# Altium schematic sheet PCB_DecoderA.SchDoc
size A4; DocumentNumber: 3; SheetNumber: 3; SheetTotal: 8
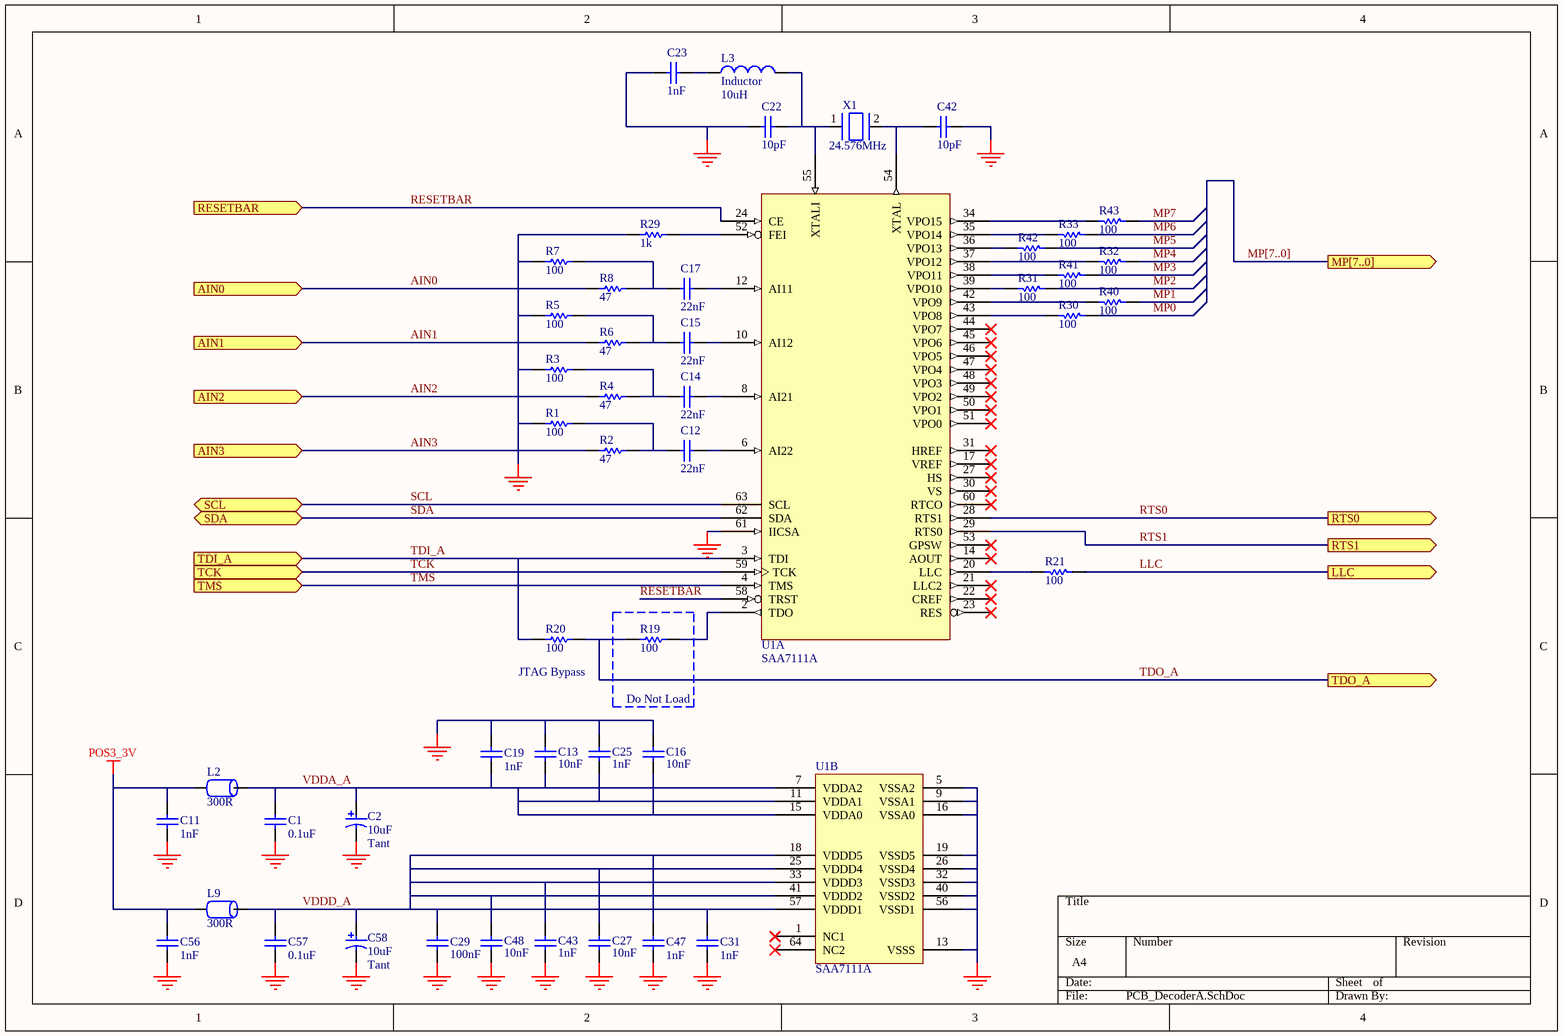
[diagram p0: PCB_DecoderA.SchDoc]

## Parts
C1  0.1uF  [CC2012-0805]
C2  10uF  Capacitor Type: Tant  [MCCT-B]
C11  1nF  [CC2012-0805]
C12  22nF  [CC2012-0805]
C13  10nF  [CC2012-0805]
C14  22nF  [CC2012-0805]
C15  22nF  [CC2012-0805]
C16  10nF  [CC2012-0805]
C17  22nF  [CC2012-0805]
C19  1nF  [CC2012-0805]
C22  10pF  [CC2012-0805]
C23  1nF  [CC2012-0805]
C25  1nF  [CC2012-0805]
C27  10nF  [CC2012-0805]
C29  100nF  [CC2012-0805]
C31  1nF  [CC2012-0805]
C42  10pF  [CC2012-0805]
C43  1nF  [CC2012-0805]
C47  1nF  [CC2012-0805]
C48  10nF  [CC2012-0805]
C56  1nF  [CC2012-0805]
C57  0.1uF  [CC2012-0805]
C58  10uF  Capacitor Type: Tant  [MCCT-B]
L2  300R  [CC2012-0805]
L3  Inductor  value 10uH  [SIMID1008-A]
L9  300R  [CC2012-0805]
R1  100  [CC2012-0805]
R2  47  [CC2012-0805]
R3  100  [CC2012-0805]
R4  47  [CC2012-0805]
R5  100  [CC2012-0805]
R6  47  [CC2012-0805]
R7  100  [CC2012-0805]
R8  47  [CC2012-0805]
R19  100  [CC2012-0805]
R20  100  [CC2012-0805]
R21  100  [CC2012-0805]
R29  1k  [CC2012-0805]
R30  100  [CC2012-0805]
R31  100  [CC2012-0805]
R32  100  [CC2012-0805]
R33  100  [CC2012-0805]
R40  100  [CC2012-0805]
R41  100  [CC2012-0805]
R42  100  [CC2012-0805]
R43  100  [CC2012-0805]
U1  SAA7111A  [QFP14X14_64]  (parts A,B of 2)
X1  24.576MHz  [QC49/SMD]

## Blocks framed on the sheet
Do Not Load: R19

## Ports
AIN0 (in), AIN1 (in), AIN2 (in), AIN3 (in), LLC (out), MP[7..0] (out), RESETBAR (in), RTS0 (out), RTS1 (out), SCL (bidir), SDA (bidir), TCK (in), TDI_A (in), TDO_A (out), TMS (in)

## Nets
GND: C1.2 C2.2 C11.2 C13.1 C16.1 C19.1 C22.1 C23.1 C25.1 C27.2 C29.2 C31.2 C42.2 C43.2 C47.2 C48.2 C56.2 C57.2 C58.2 R1.1 R3.1 R5.1 R7.1 R29.1 U1.5(VSSA2) U1.9(VSSA1) U1.13(VSSS) U1.16(VSSA0) U1.19(VSSD5) U1.26(VSSD4) U1.32(VSSD3) U1.40(VSSD2) U1.56(VSSD1) U1.61(IICSA)
POS3_3V: C11.1 C56.1 L2.1 L9.1
AIN0: R8.1 ; port AIN0
AIN1: R6.1 ; port AIN1
AIN2: R4.1 ; port AIN2
AIN3: R2.1 ; port AIN3
LLC: R21.1 ; port LLC
MP0: R30.1
MP1: R40.1
MP2: R31.1
MP3: R41.1
MP4: R32.1
MP5: R42.1
MP6: R33.1
MP7: R43.1
RESETBAR: U1.24(CE) U1.58(TRST) ; port RESETBAR
RTS0: U1.28(RTS1) ; port RTS0
RTS1: U1.29(RTS0) ; port RTS1
SCL: U1.63(SCL) ; port SCL
SDA: U1.62(SDA) ; port SDA
TCK: U1.59(TCK) ; port TCK
TDI_A: R20.1 U1.3(TDI) ; port TDI_A
TDO_A: R19.1 R20.2 ; port TDO_A
TMS: U1.4(TMS) ; port TMS
VDDA_A: C1.1 C2.1 C13.2 C16.2 C19.2 C25.2 L2.2 U1.7(VDDA2) U1.11(VDDA1) U1.15(VDDA0)
VDDD_A: C27.1 C29.1 C31.1 C43.1 C47.1 C48.1 C57.1 C58.1 L9.2 U1.18(VDDD5) U1.25(VDDD4) U1.33(VDDD3) U1.41(VDDD2) U1.57(VDDD1)
NetC12_1: C12.1 R1.2 R2.2
NetC12_2: C12.2 U1.6(AI22)
NetC14_1: C14.1 R3.2 R4.2
NetC14_2: C14.2 U1.8(AI21)
NetC15_1: C15.1 R5.2 R6.2
NetC15_2: C15.2 U1.10(AI12)
NetC17_1: C17.1 R7.2 R8.2
NetC17_2: C17.2 U1.12(AI11)
NetC22_2: C22.2 L3.2 U1.55(XTALI) X1.1
NetC23_2: C23.2 L3.1
NetC42_1: C42.1 U1.54(XTAL) X1.2
NetR19_2: R19.2 U1.2(TDO)
NetR21_2: R21.2 U1.20(LLC)
NetR29_2: R29.2 U1.52(FEI)
NetR30_2: R30.2 U1.43(VPO8)
NetR31_2: R31.2 U1.39(VPO10)
NetR32_2: R32.2 U1.37(VPO12)
NetR33_2: R33.2 U1.35(VPO14)
NetR40_2: R40.2 U1.42(VPO9)
NetR41_2: R41.2 U1.38(VPO11)
NetR42_2: R42.2 U1.36(VPO13)
NetR43_2: R43.2 U1.34(VPO15)

Not connected (* = marked no-connect by the designer): U1 1(NC1)* 14(AOUT)* 17(VREF)* 21(LLC2)* 22(CREF)* 23(RES)* 27(HS)* 30(VS)* 31(HREF)* 44(VPO7)* 45(VPO6)* 46(VPO5)* 47(VPO4)* 48(VPO3)* 49(VPO2)* 50(VPO1)* 51(VPO0)* 53(GPSW)* 60(RTCO)* 64(NC2)*

## Buses and harness runs
bus MP[7..0] = port MP[7..0]

## Notes on the sheet
- (near R20) JTAG Bypass

## Library data of the parts
C1 C11-C17 C19 C22 C23 C25 C27 C29 C31 C42 C43 C47 C48 C56 C57 = CAP: Capacitor; Fitted: True
C2 C58 = CAP_POLAR: Polar Capacitor; Fitted: True
L2 L9 = FERRITE_BEAD: BMB Series Ferrite Chip Bead
L3 = Inductor: Manufacturer: Generic Components; Class I: Passive; Published: 8-Jun-2000; Revision: July-2002: Re-released for DXP Platform.; Publisher: Altium Limited; Class II: Inductor
R1-R8 R19-R21 R29-R33 R40-R43 = RES: Resistor; Fitted: True
U1 = SAA7111A: Philips Enhanced Video Input Processor
X1 = CRYSTAL